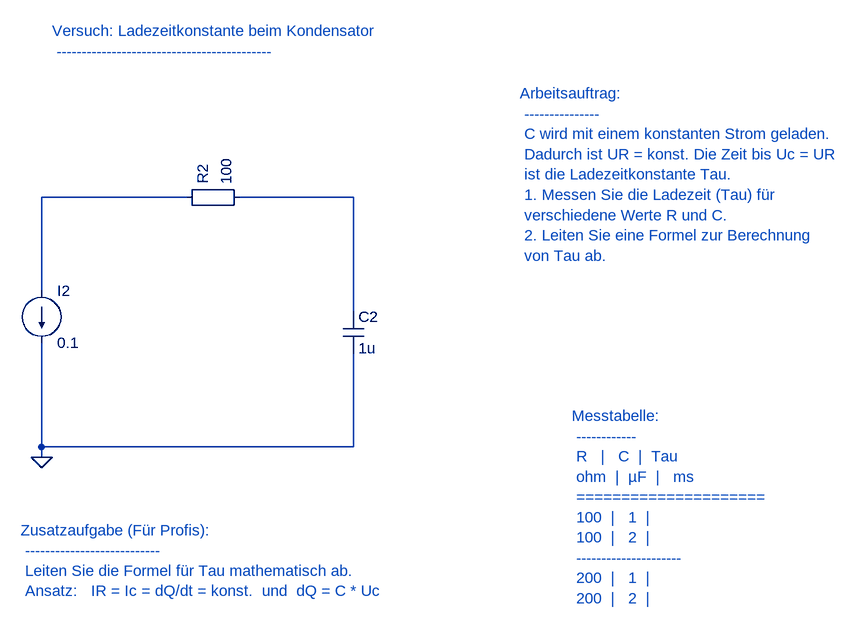
[diagram p0: schematic 1_1_2_C_Ladezeitkonstante.asc]
1_1_2_C_Ladezeitkonstante.asc, the LTspice schematic file:
Version 4
SHEET 1 880 680
WIRE 160 544 160 560
WIRE 640 560 640 576
WIRE 160 464 160 320
WIRE 160 320 384 320
WIRE 160 560 160 704
WIRE 640 496 640 320
WIRE 640 320 464 320
WIRE 160 704 160 720
WIRE 640 576 640 704
WIRE 640 704 160 704
FLAG 160 720 0
SYMBOL Misc\EuropeanResistor 368 336 R270
SYMATTR InstName R2
SYMATTR Value 100
SYMBOL current 160 464 R0
SYMATTR InstName I2
SYMATTR Value 0.1
SYMBOL cap 624 496 R0
SYMATTR InstName C2
SYMATTR Value 1u
TEXT 176 64 Left 2 ;Versuch: Ladezeitkonstante beim Kondensator \n -------------------------------------------
TEXT 896 160 Left 2 ;Arbeitsauftrag: \n --------------- \n C wird mit einem konstanten Strom geladen. \n Dadurch ist UR = konst. Die Zeit bis Uc = UR \n ist die Ladezeitkonstante Tau. \n 1. Messen Sie die Ladezeit (Tau) für \n verschiedene Werte R und C. \n 2. Leiten Sie eine Formel zur Berechnung \n von Tau ab.
TEXT 976 656 Left 2 ;Messtabelle: \n ------------ \n R   |   C  |  Tau \n ohm  |  µF  |   ms \n ===================== \n 100  |   1  | \n 100  |   2  | \n --------------------- \n 200  |   1  | \n 200  |   2  |
TEXT 128 832 Left 2 ;Zusatzaufgabe (Für Profis): \n --------------------------- \n Leiten Sie die Formel für Tau mathematisch ab. \n Ansatz:   IR = Ic = dQ/dt = konst.  und  dQ = C * Uc

The netlist it stands for:
* 1_1_2_C_Ladezeitkonstante.asc
R2 N001 N002 100
I2 N001 0 0.1
C2 N002 0 1u
* Versuch: Ladezeitkonstante beim Kondensator
*  -------------------------------------------
* Arbeitsauftrag:
*  ---------------
*  C wird mit einem konstanten Strom geladen.
*  Dadurch ist UR = konst. Die Zeit bis Uc = UR
*  ist die Ladezeitkonstante Tau.
*  1. Messen Sie die Ladezeit (Tau) für
*  verschiedene Werte R und C.
*  2. Leiten Sie eine Formel zur Berechnung
*  von Tau ab.
* Messtabelle:
*  ------------
*  R   |   C  |  Tau
*  ohm  |  µF  |   ms
*  =====================
*  100  |   1  |
*  100  |   2  |
*  ---------------------
*  200  |   1  |
*  200  |   2  |
* Zusatzaufgabe (Für Profis):
*  ---------------------------
*  Leiten Sie die Formel für Tau mathematisch ab.
*  Ansatz:   IR = Ic = dQ/dt = konst.  und  dQ = C * Uc
.backanno
.end